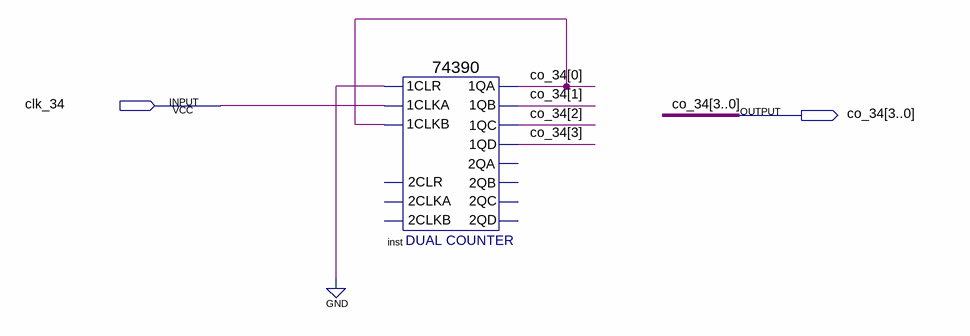
[diagram p0: schematic sheet]
// Quartus schematic m10.bdf as structural Verilog: 1 symbols, 2 pins
module m10 (
  input  clk_34,
  output [3:0] co_34
);

  \74390  inst (
    .\1CLR (1'b0), .\1CLKA (clk_34), .\1CLKB (co_34[0]), .\1QA (co_34[0]), .\1QB (co_34[1]),
    .\1QC (co_34[2]), .\1QD (co_34[3]));  // open: 2CLKA, 2CLR, 2CLKB, 2QA, 2QB, 2QC, 2QD
endmodule
